# Altium project Cheater Dice.PrjPcb
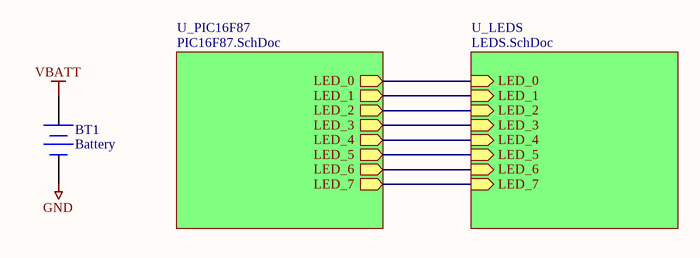
[diagram p0: Cheater Dice.SchDoc]
3 sheets, 33 parts. Net scope: hierarchical (ports join the sheet entries above them; power ports are global).
Board files: Cheater Dice V200.PcbDoc, Cheater Dice Top Cover.PcbDoc
Sheets:
  Cheater Dice.SchDoc
    U_LEDS = LEDS.SchDoc
    U_PIC16F87 = PIC16F87.SchDoc

## Sheet Cheater Dice.SchDoc
size A4

### Parts
BT1  Battery  [CR2032]

### Sub-sheets
U_LEDS = LEDS.SchDoc: LED_0 (in), LED_1 (in), LED_2 (in), LED_3 (in), LED_4 (in), LED_5 (in), LED_6 (in), LED_7 (in)
U_PIC16F87 = PIC16F87.SchDoc: LED_0 (out), LED_1 (out), LED_2 (out), LED_3 (out), LED_4 (out), LED_5 (out), LED_6 (out), LED_7 (out)

### Nets
GND: BT1.2(-)
VBATT: BT1.1(+)
LED_0: sheet U_LEDS/LED_0, sheet U_PIC16F87/LED_0
LED_1: sheet U_LEDS/LED_1, sheet U_PIC16F87/LED_1
LED_2: sheet U_LEDS/LED_2, sheet U_PIC16F87/LED_2
LED_3: sheet U_LEDS/LED_3, sheet U_PIC16F87/LED_3
LED_4: sheet U_LEDS/LED_4, sheet U_PIC16F87/LED_4
LED_5: sheet U_LEDS/LED_5, sheet U_PIC16F87/LED_5
NetR7_1: sheet U_LEDS/LED_6, sheet U_PIC16F87/LED_6
NetR8_1: sheet U_LEDS/LED_7, sheet U_PIC16F87/LED_7

### Library data of the parts
BT1 = Battery: Multicell Battery; Published: 24-Mar-1999; LatestRevisionDate: 17-Jul-2002; LatestRevisionNote: Re-released for DXP Platform.; PackageReference: BAT-2; Publisher: Altium Limited; PackageDescription: Battery; 2 Leads

## Sheet LEDS.SchDoc
size A4
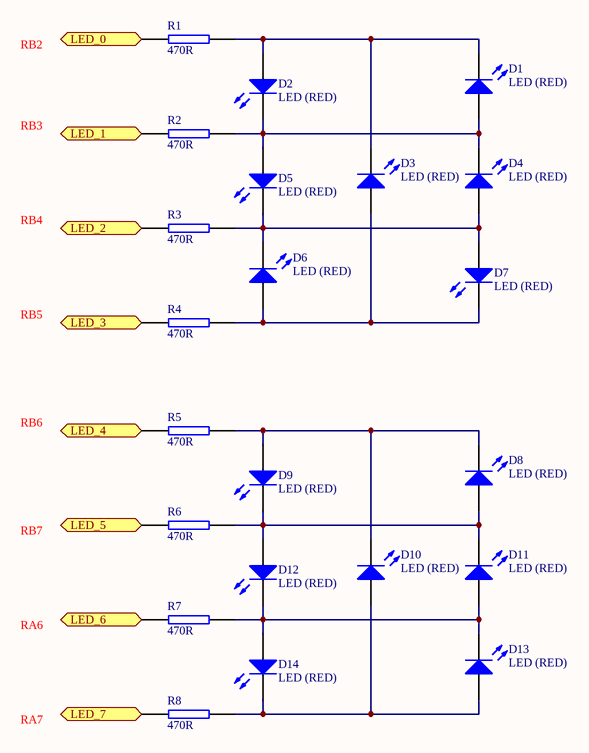
[diagram p1: LEDS.SchDoc]

### Parts
D1  LED (RED)  [PLCC_2]
D2  LED (RED)  [PLCC_2]
D3  LED (RED)  [PLCC_2]
D4  LED (RED)  [PLCC_2]
D5  LED (RED)  [PLCC_2]
D6  LED (RED)  [PLCC_2]
D7  LED (RED)  [PLCC_2]
D8  LED (RED)  [PLCC_2]
D9  LED (RED)  [PLCC_2]
D10  LED (RED)  [PLCC_2]
D11  LED (RED)  [PLCC_2]
D12  LED (RED)  [PLCC_2]
D13  LED (RED)  [PLCC_2]
D14  LED (RED)  [PLCC_2]
R1  470R  [RES (3D) - 0603]
R2  470R  [RES (3D) - 0603]
R3  470R  [RES (3D) - 0603]
R4  470R  [RES (3D) - 0603]
R5  470R  [RES (3D) - 0603]
R6  470R  [RES (3D) - 0603]
R7  470R  [RES (3D) - 0603]
R8  470R  [RES (3D) - 0603]

### Ports
LED_0 (in), LED_1 (in), LED_2 (in), LED_3 (in), LED_4 (in), LED_5 (in), LED_6 (in), LED_7 (in)

### Nets
LED_0: R1.1 ; port LED_0
LED_1: R2.1 ; port LED_1
LED_2: R3.1 ; port LED_2
LED_3: R4.1 ; port LED_3
LED_4: R5.1 ; port LED_4
LED_5: R6.1 ; port LED_5
NetD1_1: D1.1(A) D2.2(K) D4.2(K) D5.1(A) R2.2
NetD1_2: D1.2(K) D2.1(A) D3.2(K) R1.2
NetD3_1: D3.1(A) D6.1(A) D7.2(K) R4.2
NetD4_1: D4.1(A) D5.2(K) D6.2(K) D7.1(A) R3.2
NetD8_1: D8.1(A) D9.2(K) D11.2(K) D12.1(A) R6.2
NetD8_2: D8.2(K) D9.1(A) D10.2(K) R5.2
NetD10_1: D10.1(A) D13.1(A) D14.2(K) R8.2
NetD11_1: D11.1(A) D12.2(K) D13.2(K) D14.1(A) R7.2
NetR7_1: R7.1 ; port LED_6
NetR8_1: R8.1 ; port LED_7

### Notes on the sheet
- RB2
- RB3
- RB4
- RB5
- RB6
- RB7
- RA6
- RA7

### Library data of the parts
D1-D14 = LED 3mm RED: 3mm RED LED
R1-R8 = RES SMD 0603 590R: RESISTOR SMD 0603 590R; Substitute Allowed: Yes; value: 470R

## Sheet PIC16F87.SchDoc
size A4
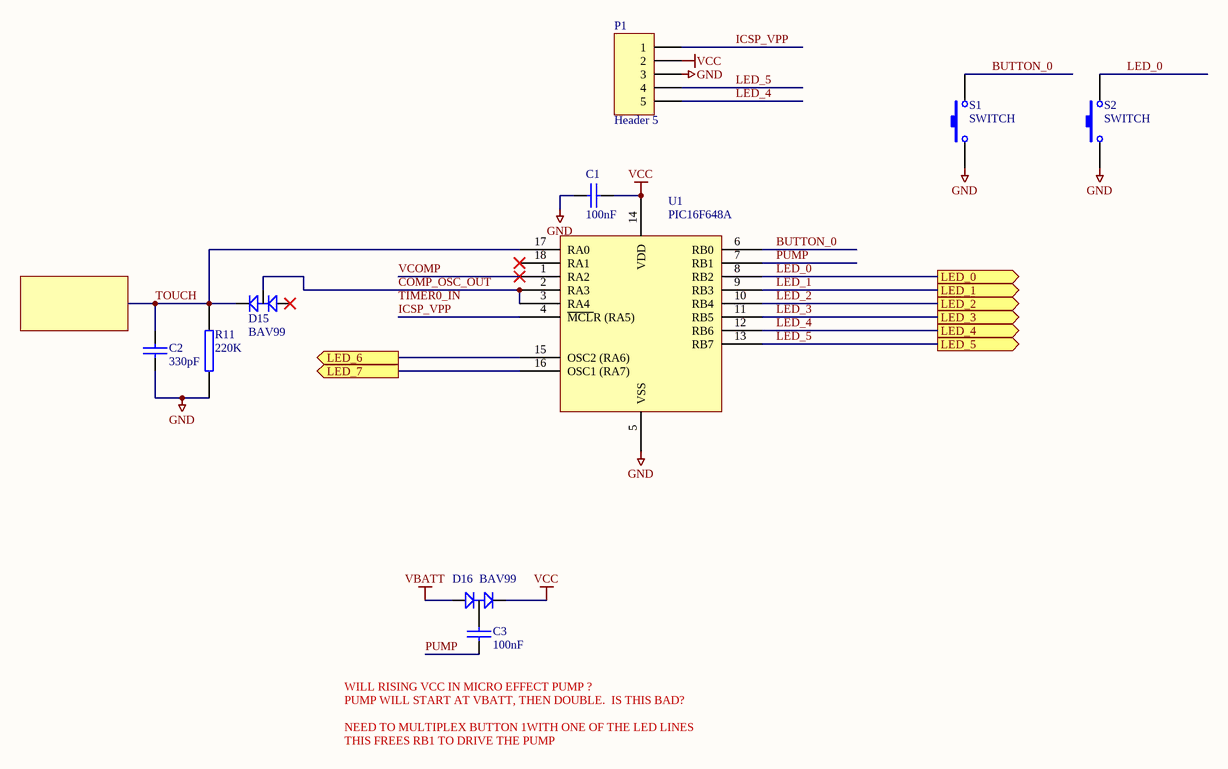
[diagram p2: PIC16F87.SchDoc]

### Parts
C1  100nF  [CAP (3D) - 0603]
C2  330pF  [CAP (3D) - 0603]
C3  100nF  [CAP (3D) - 0603]
D15  BAV99  [SOT23-3L]
D16  BAV99  [SOT23-3L]
P1  Header 5  [HDR1X5]
R11  220K  [RES (3D) - 0603]
S1  SWITCH  [TACT 6mm]
S2  SWITCH  [TACT 6mm]
U1  PIC16F648A  [SOIC-18]

### Ports
LED_0 (out), LED_1 (out), LED_2 (out), LED_3 (out), LED_4 (out), LED_5 (out), LED_6 (out), LED_7 (out)

### Nets
GND: C1.1 C2.2 P1.3 R11.1 S1.1 S2.1 U1.5(VSS)
VBATT: D16.1(A1)
VCC: C1.2 D16.2(C2) P1.2 U1.14(VDD)
BUTTON_0: S1.2 U1.6(RB0)
COMP_OSC_OUT: D15.3(C1/A2) U1.2(RA3) U1.3(RA4)
ICSP_VPP: P1.1 U1.4(~{MCL}R_(RA5))
LED_0: S2.2 U1.8(RB2) ; port LED_0
LED_1: U1.9(RB3) ; port LED_1
LED_2: U1.10(RB4) ; port LED_2
LED_3: U1.11(RB5) ; port LED_3
LED_4: P1.5 U1.12(RB6) ; port LED_4
LED_5: P1.4 U1.13(RB7) ; port LED_5
PUMP: C3.2 U1.7(RB1)
TOUCH: C2.1 D15.2(C2) R11.2 U1.17(RA0)
VCOMP: U1.1(RA2)
NetC3_1: C3.1 D16.3(C1/A2)
NetR7_1: U1.15(OSC2_(RA6)) ; port LED_6
NetR8_1: U1.16(OSC1_(RA7)) ; port LED_7

Not connected (* = marked no-connect by the designer): D15 1(A1)*; U1 18(RA1)*

### Notes on the sheet
- (near C3) WILL RISING VCC IN MICRO EFFECT PUMP ?
- PUMP WILL START AT VBATT, THEN DOUBLE.  IS THIS BAD?
- NEED TO MULTIPLEX BUTTON 1WITH ONE OF THE LED LINES
- THIS FREES RB1 TO DRIVE THE PUMP
- Labels drawn without touching a wire or pin: TIMER0_IN

### Library data of the parts
C1-C3 = CAP: CAPACITOR SMD 0402; Supplier 1: Mouser; Supplier Part Number 1: 810-CGJ3E2X7R1H104K
  C1 C3: value: 100nF
  C2: value: 330pF
D15 D16 = BAV99: DUAL DIODE, BAV99; Manufacturer: FAIRCHILD SEMICONDUCTOR; Mouser Part no.: 771-BAV99/T3; Farnell Part no.: 9843612; Manufacturer Part No.: BAV99; PackageReference: SOT-23; value: BAV99; Web link: http://au.mouser.com/ProductDetail/NXP-Semiconductors/BAV99-T3/?qs=sGAEpiMZZMtldOIVIVqa3WNg7zlWz8nBhXHsMX6ttIg%3d
P1 = Header 5: Header, 5-Pin; LatestRevisionDate: 17-Jul-2002; LatestRevisionNote: Re-released for DXP Platform.; Publisher: Altium Limited
R11 = RES: ZERO OHM LINK; value: 220K; Supplier 1: Mouser; Supplier Part Number 1: 652-CR0603JW-224ELF; Supplier 2: Digi-Key; Supplier Part Number 2: P220KHCT-ND
S1 S2 = TACT SWITCH ALPS SKQMAQ: Manufacturer: Mountain Switch; Manufacturer Part No.: 101-0264-EV; PackageReference: SPST-2; Mouser Part no.: 101-0264-EV; Web link: http://au.mouser.com/ProductDetail/Mountain-Switch/101-0264-EV/?qs=sGAEpiMZZMsgGjVA3toVBDnZjK1udZ%2fpYjk5pdxgsFo%3d; Value: SWITCH
U1 = PIC16F87/88: PIC16F88; Manufacturer: Microchip Technology; Manufacturer Part No.: PIC16F88-E/SS; Mouser Part no.: 579-PIC16F88-E/SS; Farnell Part no.: 9761519; value: PIC16F88; Web link: http://au.mouser.com/ProductDetail/Microchip-Technology/PIC16F88-E-SS/?qs=sGAEpiMZZMvu0Nwh4cA1waDrdroEY0RCb%252bRi%252b4Dz0K0%3d

## Nets that join several sheets
GND: Cheater Dice (BT1.2), PIC16F87 (7 pins)
VBATT: Cheater Dice (BT1.1), PIC16F87 (D16.1)
LED_0: LEDS (R1.1), PIC16F87 (S2.2 U1.8)
LED_1: LEDS (R2.1), PIC16F87 (U1.9)
LED_2: LEDS (R3.1), PIC16F87 (U1.10)
LED_3: LEDS (R4.1), PIC16F87 (U1.11)
LED_4: LEDS (R5.1), PIC16F87 (P1.5 U1.12)
LED_5: LEDS (R6.1), PIC16F87 (P1.4 U1.13)
NetR7_1: LEDS (R7.1), PIC16F87 (U1.15)
NetR8_1: LEDS (R8.1), PIC16F87 (U1.16)